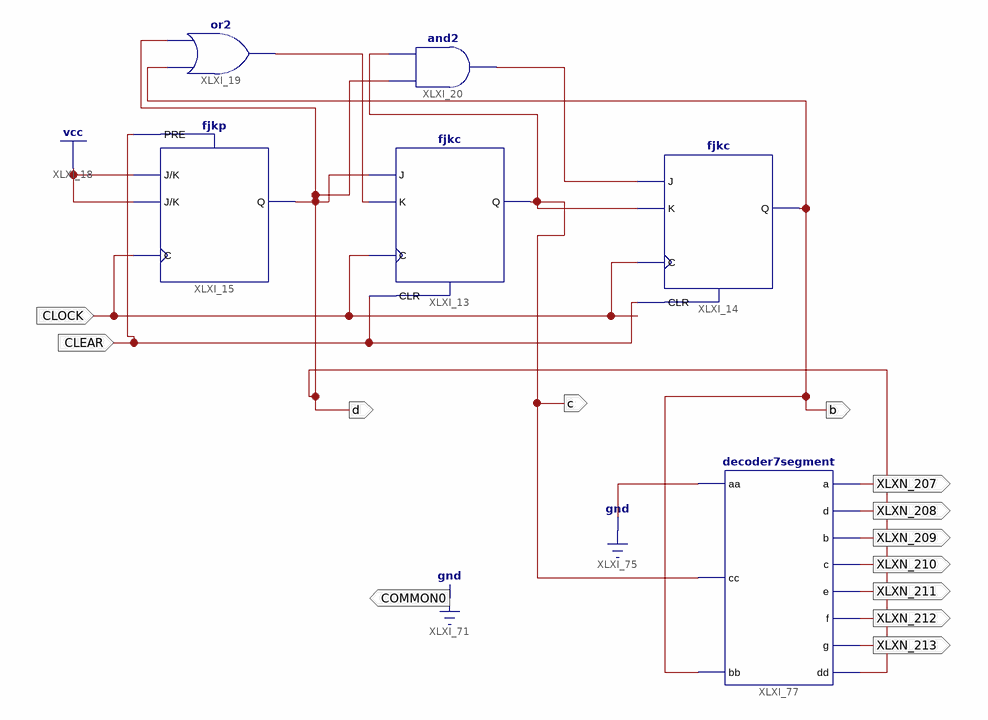
[diagram p0: schematic sheet 1]
// Xilinx ISE schematic schematic.sch (spartan6) as structural Verilog: 6 symbols, 13 ports
module schematic (
  input  CLEAR,
  input  CLOCK,
  output b,
  output c,
  output d,
  output COMMON0,
  output XLXN_207,
  output XLXN_208,
  output XLXN_209,
  output XLXN_210,
  output XLXN_211,
  output XLXN_212,
  output XLXN_213
);

  wire XLXN_53, XLXN_87;

  fjkc XLXI_13 (.C(CLOCK), .CLR(CLEAR), .J(d), .K(XLXN_53), .Q(c));
  fjkc XLXI_14 (.C(CLOCK), .CLR(CLEAR), .J(XLXN_87), .K(c), .Q(b));
  fjkp XLXI_15 (.C(CLOCK), .J(1'b1), .K(1'b1), .PRE(CLEAR), .Q(d));
  or XLXI_19 (XLXN_53, b, d);
  and XLXI_20 (XLXN_87, d, c);
  decoder7segment XLXI_77 (
    .aa(1'b0), .cc(c), .bb(b), .a(XLXN_207), .d(XLXN_208), .b(XLXN_209), .c(XLXN_210), .e(XLXN_211),
    .f(XLXN_212), .g(XLXN_213), .dd(d));

  assign COMMON0 = 1'b0;

  // Notes on the sheet:
  //   CLOCK_DEDICATED_ROUTE on signal CLOCK = TRUE
  //   LOC on signal COMMON0 = P44
endmodule
